# Altium schematic sheet Pag1_PowerSupply.SchDoc
size A4
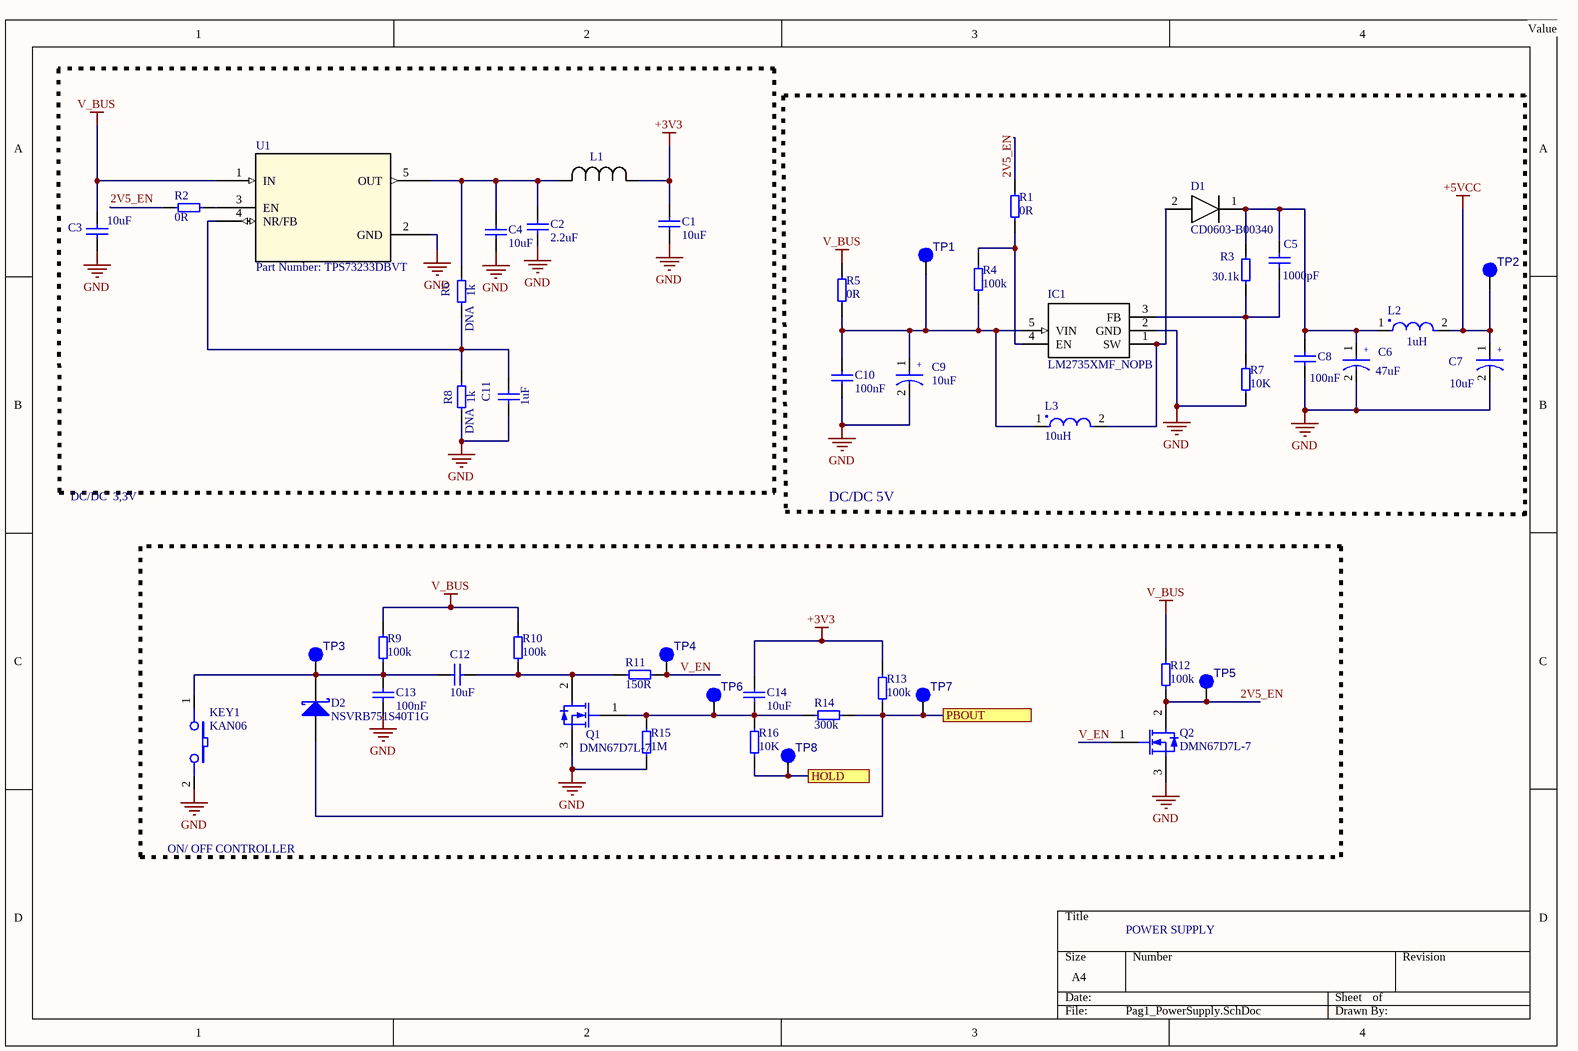
[diagram p0: Pag1_PowerSupply.SchDoc]

## Parts
C1  10uF  [0603]
C2  2.2uF  [0603]
C3  10uF  [0603]
C4  10uF  [0603]
C5  1000pF  [0603]
C6  47uF  [0805]
C7  10uF  [CAP_6.6X6.6]
C8  100nF  [0603]
C9  10uF  [CAP_6.6X6.6]
C10  100nF  [0603]
C11  1uF  [0603]
C12  10uF  [0603]
C13  100nF  [0603]
C14  10uF  [0603]
D1  CD0603-B00340  [DIOM179X85N]
D2  NSVRB751S40T1G  [D_SOD523]
IC1  LM2735XMF_NOPB  [SOT95P280X145-5N]
KEY1  KAN06  [KAN06_v2]
L1  Part Number: MLZ2012A3R3WT000  [IND_2012]  (value not drawn)
L2  1uH  [SRP4012TA]
L3  10uH  [SRP4012TA]
Q1  DMN67D7L-7  [D_SOT23]
Q2  DMN67D7L-7  [D_SOT23]
R1  0R  [0603]
R2  0R  [0603]
R3  30.1k  [0603]
R4  100k  [0603]
R5  0R  [0603]
R6  1k  PCBA: DNA  [0603]
R7  10K  [0603]
R8  1k  PCBA: DNA  [0603]
R9  100k  [0603]
R10  100k  [0603]
R11  150R  [0603]
R12  100k  [0603]
R13  100k  [0603]
R14  300k  [0603]
R15  1M  [0603]
R16  10K  [0603]
TP1  Test Point  [TEST]  (value not drawn)
TP2  Test Point  [TEST]  (value not drawn)
TP3  Test Point  [TEST]  (value not drawn)
TP4  Test Point  [TEST]  (value not drawn)
TP5  Test Point  [TEST]  (value not drawn)
TP6  Test Point  [TEST]  (value not drawn)
TP7  Test Point  [TEST]  (value not drawn)
TP8  Test Point  [TEST]  (value not drawn)
U1  Part Number: TPS73233DBVT  [DBV5]

## Blocks framed on the sheet
DC/DC 5V: C5-C10 D1 IC1 L2 L3 R1 R3-R5 R7 TP1 TP2
ON/ OFF CONTROLLER: C12-C14 D2 KEY1 Q1 Q2 R9-R16 TP3-TP8

## Ports
HOLD, PBOUT

## Nets
+3V3: C1.2 C14.1 L1.1 R13.2
+5VCC: C7.1 L2.2 TP2.1(TP)
GND: C1.1 C2.1 C3.1 C4.1 C6.2 C7.2 C8.1 C9.2 C10.1 C11.1 C13.1 IC1.2(GND) KEY1.2 Q1.3(S) Q2.3(S) R7.1 R8.2 R15.2 U1.2(GND)
V_BUS: C3.2 R5.2 R9.2 R10.2 R12.2 U1.1(IN)
2V5_EN: Q2.2(D) R1.2 R2.2 R12.1 TP5.1(TP)
HOLD: R16.2 TP8.1(TP) ; port HOLD
PBOUT: D2.A R13.1 R14.2 TP7.1(TP) ; port PBOUT
V_EN: Q2.1(G) R11.1 TP4.1(TP)
NetC2_2: C2.2 C4.2 L1.2 R6.1 U1.5(OUT)
NetC5_1: C5.1 IC1.3(FB) R3.1 R7.2
NetC5_2: C5.2 C6.1 C8.2 D1.1(K) L2.1 R3.2
NetC9_1: C9.1 C10.2 IC1.5(VIN) L3.1 R4.1 R5.1 TP1.1(TP)
NetC11_2: C11.2 R6.2 R8.1 U1.4(NR/FB)
NetC12_1: C12.1 Q1.2(D) R10.1 R11.2
NetC12_2: C12.2 C13.2 D2.K KEY1.1 R9.1 TP3.1(TP)
NetC14_2: C14.2 Q1.1(G) R14.1 R15.1 R16.1 TP6.1(TP)
NetD1_2: D1.2(A) IC1.1(SW) L3.2
NetIC1_4: IC1.4(EN) R1.1 R4.2
NetR2_1: R2.1 U1.3(EN)

## Notes on the sheet
- Value
- DC/DC  3,3V
- POWER SUPPLY
- (in symbol Cap Pol) +
- (in symbol Cap Pol_1) +

## Library data of the parts
C1 C4 = Cap: Multilayer Ceramic Capacitors MLCC - SMD/SMT 10uF 0603 10V 10%; Manufacturer: Murata Electronics; MPN: GRM188R61A106KE69D; PCBA: Assembly; Moeda: Dólar; NCM: 85322410; Datasheet: https://www.mouser.com/datasheet/2/281/murata_03052018_GRM_Series_1-1310166.pdf; Value: 10uF; Link/Contato: https://octopart.com/grm188r61a106ke69d-murata-22851381?r=sp; Supplier: Mouser
C2 = CAP_1uF: Multilayer Ceramic Capacitors MLCC - SMD/SMT 2.2uF 0603 16V 20%; Manufacturer: Wurth Electronics; MPN: 885012106018; PCBA: Assembly; Moeda: Dólar; NCM: 85322410; Datasheet: https://www.mouser.com/datasheet/2/445/885012106018-1727438.pdf; Value: 2.2uF; Link/Contato: https://octopart.com/885012106018-wurth+elektronik-53914723?r=sp; Supplier: Mouser
C3 = CAP_1uF: Multilayer Ceramic Capacitors MLCC - SMD/SMT 10uF 0603 10V 10%; Manufacturer: Murata Electronics; MPN: GRM188R61A106KE69D; PCBA: Assembly; Moeda: Dólar; NCM: 85322410; Datasheet: https://www.mouser.com/datasheet/2/212/KEM_C1006_X5R_SMD-1103249.pdf; Value: 10uF; Link/Contato: https://octopart.com/grm188r61a106ke69d-murata-22851381?r=sp; Supplier: Mouser
C5 = Cap_1: Capacitor Ceramic 1000pF 10% 16V 0603 (1608 Metric); MPN: 06033C102KAT2A; Manufacturer: Kyocera AVX; PCBA: Assembly; Moeda: Dólar; NCM: 85322410; Value: 1000pF; Link/Contato: https://octopart.com/06033c102kat2a-avx-2374779?r=sp; Supplier: Mouser
C6 = Cap Pol: Multilayer Ceramic Capacitors MLCC - SMD/SMT 47uF 0805 10V 20%; Manufacturer: Murata Electronics; MPN: GRM21BR61A476ME15K; PCBA: Assembly; Moeda: Dólar; NCM: 85322410; Value: 47uF; Link/Contato: https://octopart.com/grm21br61a476me15k-murata-46693540?r=sp; Supplier: Mouser
C7 C9 = Cap Pol_1: Capacitor Electrolytic 10uF 20% 16V; MPN: UUQ1C100MCL1GB; Manufacturer: Murata Electronics; PCBA: Assembly; Moeda: Dólar; NCM: 85322200; Value: 10uF; Link/Contato: https://octopart.com/uuq1c100mcl1gb-nichicon-19118150?r=sp; Supplier: Mouser
C8 C10 C13 = Cap_1: Multilayer Ceramic Capacitors MLCC - SMD/SMT 100nF 16V 0603 10%; MPN: C0603C104K4RACTU; Manufacturer: Kemet; PCBA: Assembly; Moeda: Dólar; NCM: 85322410; Value: 100nF; Link/Contato: https://octopart.com/c0603c104k4ractu-kemet-93067?r=sp; Supplier: Mouser
C11 = CAP_1uF: Multilayer Ceramic Capacitors MLCC - SMD/SMT 1uF 25V 0603 10%; Manufacturer: Samsung Electro-Mechanics; MPN: CL10A105KA8NNNC; PCBA: Assembly; Moeda: Dólar; NCM: 85322410; Datasheet: https://www.mouser.com/datasheet/2/445/885012106022-553988.pdf; Value: 1uF; Link/Contato: https://octopart.com/cl10a105ka8nnnc-samsung-9300957?r=sp; Supplier: Mouser
C12 C14 = Cap: Multilayer Ceramic Capacitors MLCC - SMD/SMT 10uF 0603 10V 10%; MPN: GRM188R61A106KE69D; Manufacturer: Murata Electronics; PCBA: Assembly; Moeda: Dólar; NCM: 85322410; Value: 10uF; Link/Contato: https://octopart.com/grm188r61a106ke69d-murata-22851381?r=sp; Supplier: Mouser
D1 = CD0603-B00340: Diode; MPN: CDBU0130R; Manufacturer: Comchip Technology; PCBA: Assembly; Moeda: Dólar; NCM: 85412120; Value: CD0603-B00340; Datasheet: https://datasheet.datasheetarchive.com/originals/distributors/Datasheets-DGA23/1390916.pdf; Link/Contato: https://octopart.com/cdbu0130r-comchip-19043158?r=sp; Supplier: Mouser
D2 = Schottky Diode: Schottky Diodes & Rectifiers SS 40V SHTKY SOD523; Manufacturer: onsemi; PCBA: Assembly; Moeda: Dólar; NCM: 85412120; MPN: NSVRB751S40T1G; Value: NSVRB751S40T1G; Link/Contato: https://octopart.com/nsvrb751s40t1g-onsemi-54318045?r=sp; Supplier: Mouser
IC1 = LM2735XMF_NOPB: Integrated Circuit; MPN: LM2735XMF/NOPB; Manufacturer: Texas Instruments; PCBA: Assembly; Moeda: Dólar; NCM: 85423120; Value: LM2735XMF_NOPB; Datasheet: http://www.ti.com/lit/ds/symlink/lm2735.pdf; Link/Contato: https://octopart.com/lm2735xmf%2Fnopb-texas+instruments-24813274?r=sp; Supplier: Mouser
KEY1 = SDS: Manufacturer: Metaltex; PCBA: Assembly; Moeda: Dólar; NCM: 85365090; Observações: Alternativo: TS11-674-73-BK-100-RA-D; Datasheet: www.metaltex.com.br/assets/produtos/pdf/a0.pdf; MPN: KAN06; Value: KAN06; Supplier: Mouser
L1 = MLZ2012A3R3WT000: No Description Available; Manufacturer: TDK; PCBA: DNA; Moeda: Dólar; NCM: 85045000; MPN: MLZ2012A3R3WT000; Datasheet: https://www.mouser.com/datasheet/2/400/nductor_commercial_decoupling_mlz2012_en-918301.pdf; Value: MLZ2012A3R3WT000; Link/Contato: https://octopart.com/mlz2012a3r3wt000-tdk-34829259?r=sp; Supplier: Mouser
L2 = IC_1uH: Power Inductors - SMD 1uH 20% SMD 4012 AEC-Q200; Manufacturer: Bourns; MPN: SRP4012TA-1R0M; PCBA: DNA; Value: 1uH 20%; Moeda: Dólar; NCM: 85045000; Datasheet: https://www.mouser.com/datasheet/2/54/rp4012ta-1391620.pdf; Link/Contato: https://octopart.com/srp4012ta-1r0m-bourns-47284976?r=sp; Supplier: Mouser
L3 = IC_1uH: Power Inductors - SMD 10uH 20% SMD 4012 AEC-Q200; Manufacturer: Bourns; MPN: SRP4012TA-100M; PCBA: Assembly; Moeda: Dólar; NCM: 85045000; Datasheet: https://www.mouser.com/datasheet/2/54/rp4012ta-1391620.pdf; Value: 10uH 20%; Link/Contato: https://octopart.com/srp4012ta-1r0m-bourns-47284976?r=sp; Supplier: Mouser
Q1 Q2 = MOSFET N-Ch: MOSFET BVDSS: 41V-60V; Manufacturer: Diodes Incorporated; PCBA: Assembly; Moeda: Dólar; NCM: 85412120; MPN: DMN67D7L-7; Value: DMN67D7L-7; Link/Contato: https://octopart.com/dmn67d7l-7-diodes+inc.-88723828?r=sp; Supplier: Mouser
R1 R5 = Res_1: Thick Film Resistors - SMD 0 Ohms 100 mW 0603 5%; MPN: RC0603JR-070RL; Manufacturer: Yageo; PCBA: Assembly; Moeda: Dólar; NCM: 85332120; Value: 0R; Link/Contato: https://octopart.com/rc0603jr-070rl-yageo-1241539?r=sp; Supplier: Mouser
R2 = Res: Thick Film Resistors - SMD 0 Ohms 100 mW 0603 5%; MPN: RC0603JR-070RL; Manufacturer: Yageo; PCBA: Assembly; Moeda: Dólar; NCM: 85332120; Value: 0R; Link/Contato: https://octopart.com/rc0603jr-070rl-yageo-1241539?r=sp; Supplier: Mouser
R3 = Res_1: Resistor Thick Film 30.1k 1% 0.1W, 1/10W 0603 (1608 metric) +/- 100 PPM / K; MPN: RC0603FR-0730K1L; Manufacturer: Yageo; PCBA: Assembly; Moeda: Dólar; NCM: 85332120; Value: 30.1k; Link/Contato: https://octopart.com/rc0603fr-0730k1l-yageo-55458484?r=sp; Supplier: Mouser
R4 = Res_1: Thick Film Resistors - SMD 100 kOhms 0603 100mW 1%; MPN: RC0603FR-07100KL; Manufacturer: Yageo; PCBA: Assembly; Moeda: Dólar; NCM: 85332120; Value: 100k; Link/Contato: https://octopart.com/rc0603fr-07100kl-yageo-40946036?r=sp; Supplier: Mouser
R6 R8 = Pullup_Res_1k_0603_RES: Thick Film Resistors - SMD 1 kOhms 100 mW 0603 5%; MPN: RC0603JR-071KL; Manufacturer: Yageo; Moeda: Dólar; NCM: 85332120; Datasheet: https://www.mouser.com/datasheet/2/447/PYu-RC_Group_51_RoHS_L_10-1527934.pdf; Value: 1K; Link/Contato: https://octopart.com/rc0603jr-071kl-yageo-55402888?r=sp; Supplier: Mouser
R7 = Res_1: Thick Film Resistors - SMD 10 kOhms 100-200 mW 0603 1%; MPN: RC0603FR-1310KL; Manufacturer: Yageo; PCBA: Assembly; Moeda: Dólar; NCM: 85332120; Value: 10K; Datasheet: https://www.mouser.com/datasheet/2/447/PYu-RC_Group_51_RoHS_L_10-1527934.pdf; Link/Contato: https://octopart.com/rc0603fr-1310kl-yageo-11543875?r=sp; Supplier: Mouser
R9 R10 = Res_1: Thick Film Resistors - SMD 100 kOhms 0603 100mW 1%; MPN: RC0603FR-07100KL; Manufacturer: YAGEO; PCBA: Assembly; Moeda: Dólar; NCM: 85332120; Value: 100k; Link/Contato: https://octopart.com/rc0603fr-07100kl-yageo-40946036?r=sp; Supplier: Mouser
R11 = Res: Thick Film Resistors - SMD 150 Ohms 0603 100mW 5%; MPN: CR0603-JW-151ELF; Manufacturer: Bourns; PCBA: Assembly; Moeda: Dólar; NCM: 85332120; Value: 150R; Link/Contato: https://octopart.com/cr0603-jw-151elf-bourns-2566617?r=sp; Supplier: Mouser
R12 R13 = Res: Thick Film Resistors - SMD 100 kOhms 0603 100mW 1%; MPN: RC0603FR-07100KL; Manufacturer: YAGEO; PCBA: Assembly; Moeda: Dólar; NCM: 85332120; Value: 100k; Link/Contato: https://octopart.com/rc0603fr-07100kl-yageo-40946036?r=sp; Supplier: Mouser
R14 = Res: Thick Film Resistors - SMD 300 kOhms 0603 100mW 1%; MPN: RC0603FR-07300KL; Manufacturer: Yageo; PCBA: Assembly; Moeda: Dólar; NCM: 85332120; Value: 300k; Link/Contato: https://octopart.com/rc0603fr-07300kl-yageo-1190095?r=sp; Supplier: Mouser
R15 = Res: Thick Film Resistors - SMD 1 MOhms 100mW 0603 1%; MPN: RC0603FR-071ML; Manufacturer: Yageo; PCBA: Assembly; Moeda: Dólar; NCM: 85332120; Value: 1M; Link/Contato: https://octopart.com/rc0603fr-071ml-yageo-1168402?r=sp; Supplier: Mouser
R16 = Res: Thick Film Resistors - SMD 10 kOhms 100-200 mW 0603 1%; MPN: RC0603FR-1310KL; Manufacturer: Yageo; PCBA: Assembly; Moeda: Dólar; NCM: 85332120; Value: 10K; Datasheet: https://www.mouser.com/datasheet/2/447/PYu-RC_Group_51_RoHS_L_10-1527934.pdf; Link/Contato: https://octopart.com/rc0603fr-1310kl-yageo-11543875?r=sp; Supplier: Mouser
TP1-TP8 = TESTPOINT: MPN: Test_Point; Manufacturer: DNA; PCBA: DNA; Value: Test Point
U1 = TPS73225DBVT: LDO Voltage Regulators Cap-Free NMOS 250mA; Manufacturer: Texas Instruments; MPN: TPS73233DBVR; PCBA: Assembly; Moeda: Dólar; NCM: 85423120; Datasheet: http://www.ti.com/lit/ds/symlink/tps732.pdf; Value: TPS73233DBVT; Link/Contato: https://octopart.com/tps73233dbvr-texas+instruments-2359245?r=sp; Supplier: Mouser